# EAGLE design untitled2 (EAGLE 8.6.1)
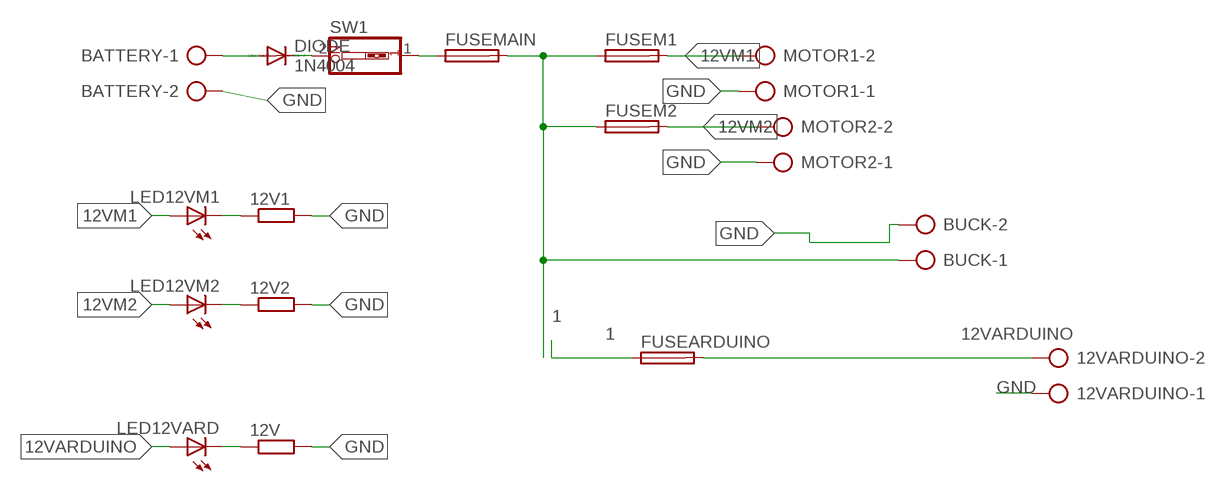
[diagram p0: schematic, sheet 1]

## Parts
12V  R-EU_0204/7  [0204/7]
12V1  R-EU_0204/7  [0204/7]
12V2  R-EU_0204/7  [0204/7]
12VARDUINO  AK500/2-H  [AK500/2-H]
BATTERY  AK500/2-H  [AK500/2-H]
BUCK  AK500/2-H  [AK500/2-H]
DIODE  1N4004  [DO41-10]
FUSEARDUINO  SH22,5  [SH22,5]
FUSEM1  SH22,5  [SH22,5]
FUSEM2  SH22,5  [SH22,5]
FUSEMAIN  SH22,5  [SH22,5]
LED12VARD  LEDLSU260  [LSU260]
LED12VM1  LEDLSU260  [LSU260]
LED12VM2  LEDLSU260  [LSU260]
MOTOR1  AK500/2-H  [AK500/2-H]
MOTOR2  AK500/2-H  [AK500/2-H]
SW1  SW_DIP-1  [EDG-01]

## Nets
1: BUCK.1 FUSEARDUINO.1 FUSEM1.1 FUSEM2.1 FUSEMAIN.2
12VARDUINO: 12VARDUINO.2 FUSEARDUINO.2 LED12VARD.A
12VM1: FUSEM1.2 LED12VM1.A MOTOR1.2
12VM2: FUSEM2.2 LED12VM2.A MOTOR2.2
GND: 12V1.2 12V2.2 12V.2 12VARDUINO.1 BATTERY.2 BUCK.2 MOTOR1.1 MOTOR2.1
N$1: BATTERY.1 DIODE.A
N$2: DIODE.C SW1.2
N$3: FUSEMAIN.1 SW1.1
N$8: 12V2.1 LED12VM2.K(C)
N$9: 12V1.1 LED12VM1.K(C)
N$10: 12V.1 LED12VARD.K(C)

## Library data of the parts
12V 12V1 12V2 = resistor:R-EU_: RESISTOR, European symbol
12VARDUINO BATTERY BUCK MOTOR1 MOTOR2 = con-ptr500:AK500/2-H: CONNECTOR Aug. 2004 / PTR Meßtechnik: Die Bezeichnung der Serie AK505 wurde geändert. Es handelt sich hierbei um AK500 in horizontaler Ausführung.; OC_FARNELL: unknown; OC_NEWARK: unknown
DIODE = diode:1N4004: DIODE general purpose rectifier, 1 A
FUSEARDUINO FUSEM1 FUSEM2 FUSEMAIN = fuse:SH22,5: FUSE HOLDER grid 22,5 mm, OGN0031 8201, Schurter (Buerklin); MF: SCHURTER; MPN: 0031.8201; OC_FARNELL: 1162740; OC_NEWARK: 96F8317
LED12VARD LED12VM1 LED12VM2 = led:LED: LED OSRAM: - CHIPLED LG R971, LG N971, LY N971, LG Q971, LY Q971, LO R971, LY R971 LH N974, LH R974 LS Q976, LO Q976, LY Q976 LO Q996 - Hyper CHIPLED LW Q18S LB Q993, LB Q99A, LB R99A - SideLED LS A670, LO A670, LY A670, LG A670, LP A670 LB A673, LV A673, LT A673, LW A673 LH A674 LY A675 LS A676, LA A676, LO A676, LY A676, LW A676 LS A679, LY A679, LG A679 - Hyper Micro SIDELED® LS Y876, LA Y876, LO Y876, LY Y876 LT Y87S - SmartLED LW L88C, LW L88S LB L89C, LB L89S, LG L890 LS L89K, LO L89K, LY L89K LS L896, LA L896, LO L896, LY L896 - TOPLED LS T670, LO T670, LY T670, LG T670, LP T670 LSG T670, LSP T670, LSY T670, LOP T670, LYG T670 LG T671, LOG T671, LSG T671 LB T673, LV T673, LT T673, LW T673 LH T674 LS T676, LA T676, LO T676, LY T676, LB T676, LH T676, LSB T676, LW T676 LB T67C, LV T67C, LT T67C, LS T67K, LO T67K, LY T67K, LW E67C LS E67B, LA E67B, LO E67B, LY E67B, LB E67C, LV E67C, LT E67C LW T67C LS T679, LY T679, LG T679 LS T770, LO T770, LY T770, LG T770, LP T770 LB T773, LV T773, LT T773, LW T773 LH T774 LS E675, LA E675, LY E675, LS T675 LS T776, LA T776, LO T776, LY T776, LB T776 LHGB T686 LT T68C, LB T68C - Hyper Mini TOPLED® LB M676 - Mini TOPLED Santana® LG M470 LS M47K, LO M47K, LY M47K Source: http://www.osram.convergy.de LUXEON: - LUMILED® LXK2-PW12-R00, LXK2-PW12-S00, LXK2-PW14-U00, LXK2-PW14-V00 LXK2-PM12-R00, LXK2-PM12-S00, LXK2-PM14-U00 LXK2-PE12-Q00, LXK2-PE12-R00, LXK2-PE12-S00, LXK2-PE14-T00, LXK2-PE14-U00 LXK2-PB12-K00, LXK2-PB12-L00, LXK2-PB12-M00, LXK2-PB14-N00, LXK2-PB14-P00, LXK2-PB14-Q00 LXK2-PR12-L00, LXK2-PR12-M00, LXK2-PR14-Q00, LXK2-PR14-R00 LXK2-PD12-Q00, LXK2-PD12-R00, LXK2-PD12-S00 LXK2-PH12-R00, LXK2-PH12-S00 LXK2-PL12-P00, LXK2-PL12-Q00, LXK2-PL12-R00 Source: www.luxeon.com KINGBRIGHT: KA-3528ASYC Source: www.kingbright.com
SW1 = special:SW_DIP-1: DIP SWITCH

## Board
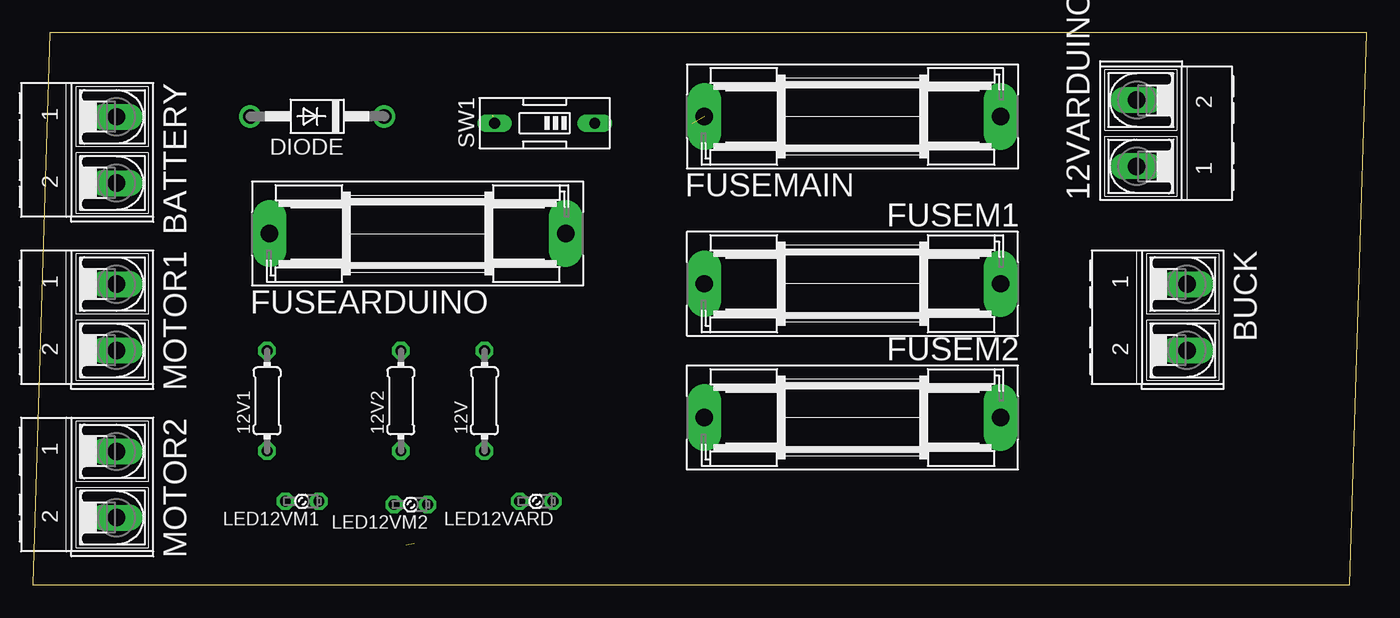
[diagram p1: board, top side]
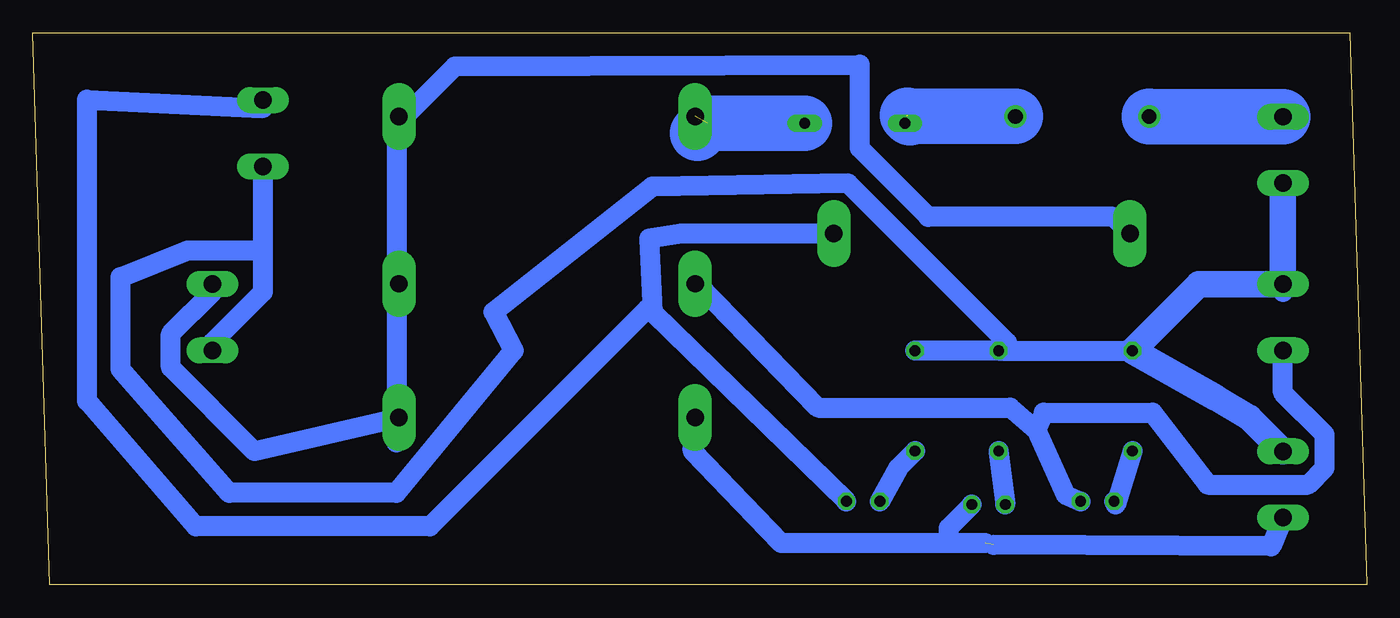
[diagram p2: board, bottom side, seen from below]

Size 101.27 x 41.9 mm. Coordinates in mm from the lower left corner, seen from the top.
Outline: 0,0 100,0 101.27,41.9 1.27,41.9 0,0
Copper layers (1*16): Top 0.035mm / dielectric 1.5mm / Bottom 0.035mm
Design rules "default *": minimum track width 1.5mm, minimum drill 0.35mm, track to track 0.4mm, track to pad 0.4mm, pad to pad 6mil, via to via 6mil, smd to smd 6mil, copper to edge 40mil, drill to drill 6mil, minimum pad ring 10mil, minimum via ring 8mil, stop-mask expansion 4mil, vias tented up to drill 0mil, thermal gap 10mil

### Footprints (pad centres in the part's own frame; a part is rotated, then mirrored left to right if it is on the bottom)
0204/7 = drill 0.813 octagon: 1 -3.81,0; 2 3.81,0
AK500/2-H = drill 1.321 long: 1 -2.515,0; 2 2.515,0
DO41-10 = drill 1.118: A 5.08,0; C -5.08,0
SH22,5 = drill 1.321 pad 2.54 long: 1 -11.252,0; 2 11.252,0
LSU260 = drill 0.813 octagon: A -1.27,0; K 1.27,0
EDG-01 = drill 0.813 long: 1 0,-3.81; 2 0,3.81

### Placement (x,y rotation side)
12V  34.29,13.97 90 top
12V1  17.78,13.97 90 top
12V2  27.94,13.97 90 top
12VARDUINO  83.82,34.29 90 top
BATTERY  6.35,33.02 270 top
BUCK  87.63,20.32 270 top
DIODE  21.59,35.56 180 top
FUSEARDUINO  29.21,26.67 0 top
FUSEM1  62.23,22.86 180 top
FUSEM2  62.23,12.7 180 top
FUSEMAIN  62.23,35.56 0 top
LED12VARD  38.23,6.35 180 top
LED12VM1  20.45,6.35 180 top
LED12VM2  28.7,6.1 180 top
MOTOR1  6.35,20.32 270 top
MOTOR2  6.35,7.62 270 top
SW1  38.86,35.05 90 top

### Tracks (layer width: path | path; a pad name or v marks a point on that pad's centre or on a via)
1
  Bottom 1.5: BUCK.1 87.63,22.23 90.8,19.05 90.8,16.51 84.45,10.16 FUSEM2.1 73.66,10.8 73.66,22.23 FUSEM1.1 73.66,22.86 73.66,34.93 FUSEMAIN.2 73.02,35.56 69.21,39.37 38.48,39.5 38.48,33.15 33.27,27.94 19.23,27.94 FUSEARDUINO.1
12VARDUINO
  Bottom 1.5: 54.23,20.7 LED12VARD.A | 54.23,20.7 54.48,26.29 52.07,26.67 FUSEARDUINO.2 | 12VARDUINO.2 83.82,36.2 97.16,36.83 97.16,13.97 88.9,4.45 71.12,4.45 54.61,20.95 54.23,20.7
12VM1
  Bottom 1.5: LED12VM1.A 22.86,6.86 25.08,11.75 | 25.08,11.75 27.05,13.46 41.66,13.46 50.8,22.86 FUSEM1.2 | MOTOR1.2 6.35,14.6 3.17,11.43 3.17,8.89 4.45,7.62 12.06,7.62 16.26,13.08 24.51,13.08 25.08,11.75
12VM2  (1 unrouted)
  Bottom 1.5: 28.32,3.05 7.24,2.92 6.35,5.08 MOTOR2.2 | FUSEM2.2 51.18,10.16 44.45,3.17 31.75,3.17 | 28.96,3.17 31.75,3.17 | LED12VM2.A 31.75,4.32 31.75,3.17
GND
  Bottom 1.5: 12VARDUINO.1 83.82,25.4 | 83.82,25.4 83.82,22.23 87.63,18.41 BUCK.2 | 12V2.2 12V1.2 17.14,17.78 | 12V2.2 12V.2 | 12V2.2 27.3,17.78 27.3,18.41 39.37,30.48 54.23,30.23 66.29,20.7 64.77,17.78 73.66,6.98 86.36,6.98 94.61,16.38 94.61,23.37 89.53,25.4 83.82,25.4 | 6.35,10.16 MOTOR2.1 | 6.35,22.23 MOTOR1.1
  Bottom 2: MOTOR2.1 8.91,12.7 11.43,14.22 12V1.2 12.72,22.84 MOTOR1.1 BATTERY.2
N$1
  Bottom 1.5: 6.35,35.56 BATTERY.1
  Bottom 4.2: BATTERY.1 16.48,35.54 DIODE.A
N$2  (1 unrouted)
  Bottom 1.5: 34.93,35.56 SW1.2
  Bottom 4.2: DIODE.C 34.29,35.56 34.54,35.56 | 34.77,35.56 34.54,35.56 | 34.85,35.64 34.77,35.56 | 34.77,35.56 34.66,35.45 34.54,35.56
N$3  (1 unrouted)
  Bottom 1.5: 43.18,35.56 SW1.1
  Bottom 4.2: SW1.1 50.04,35.05 50.8,34.29
N$8
  Bottom 1.5: 12V2.1 LED12VM2.K
N$9
  Bottom 1.5: LED12VM1.K 19.05,6.1 12V1.1
N$10
  Bottom 1.5: LED12VARD.K 35.56,8.89 12V.1